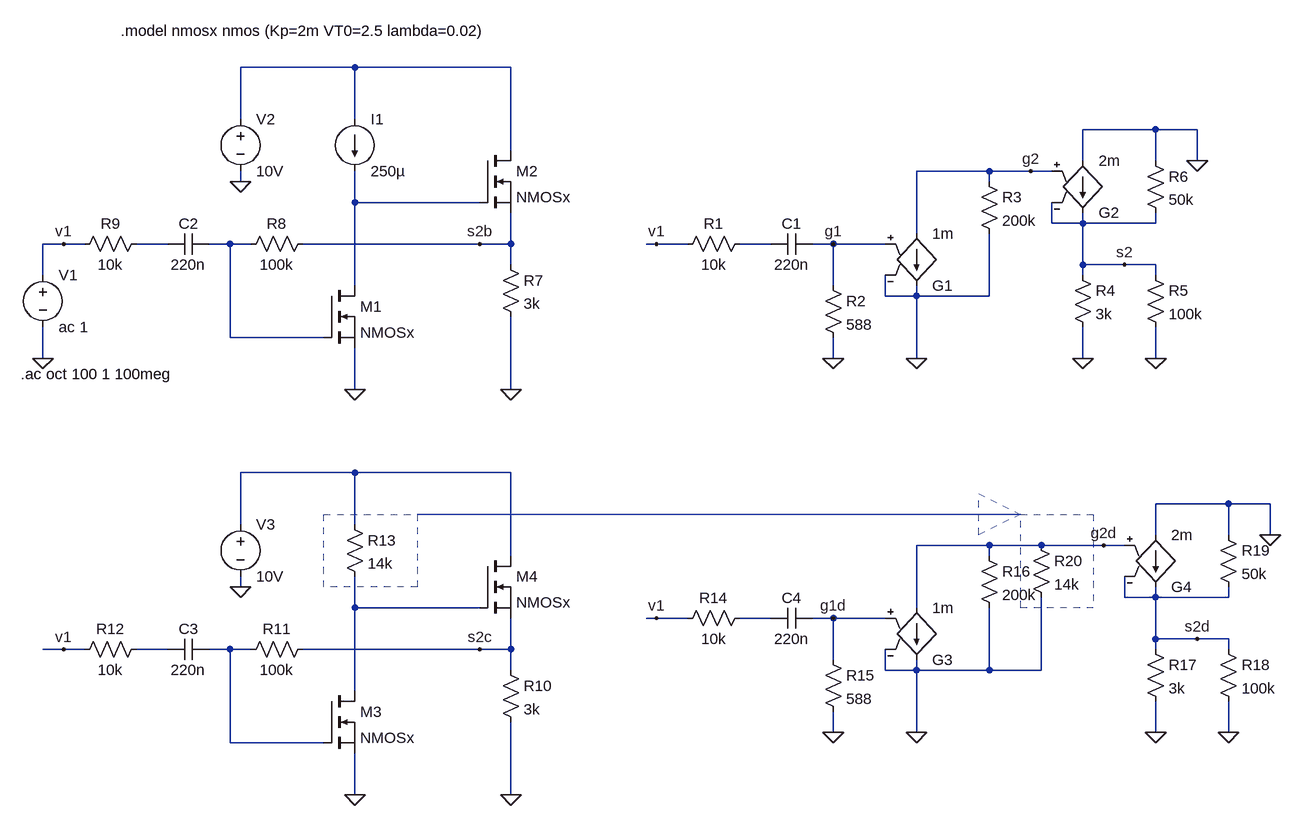
[diagram p0: schematic ss2011.asc]
ss2011.asc, the LTspice schematic file:
Version 4
SHEET 1 1156 1556
WIRE -448 -160 -624 -160
WIRE -208 -160 -448 -160
WIRE -624 -80 -624 -160
WIRE -448 -80 -448 -160
WIRE 784 -64 672 -64
WIRE 848 -64 784 -64
WIRE -208 -32 -208 -160
WIRE 672 -16 672 -64
WIRE 784 -16 784 -64
WIRE 848 -16 848 -64
WIRE 528 0 416 0
WIRE 592 0 528 0
WIRE 624 0 592 0
WIRE -624 16 -624 0
WIRE 528 16 528 0
WIRE -448 48 -448 0
WIRE -256 48 -448 48
WIRE 624 80 624 48
WIRE 672 80 672 64
WIRE 672 80 624 80
WIRE 784 80 784 64
WIRE 784 80 672 80
WIRE 416 96 416 0
WIRE -896 112 -928 112
WIRE -864 112 -896 112
WIRE -736 112 -784 112
WIRE -640 112 -672 112
WIRE -608 112 -640 112
WIRE -256 112 -528 112
WIRE -208 112 -208 64
WIRE -208 112 -256 112
WIRE 16 112 0 112
WIRE 64 112 16 112
WIRE 192 112 144 112
WIRE 288 112 256 112
WIRE 368 112 288 112
WIRE -208 144 -208 112
WIRE 672 144 672 80
WIRE 736 144 672 144
WIRE 784 144 736 144
WIRE -928 160 -928 112
WIRE 672 160 672 144
WIRE 784 160 784 144
WIRE -448 176 -448 48
WIRE 288 176 288 112
WIRE 368 192 368 160
WIRE 416 192 416 176
WIRE 416 192 368 192
WIRE 528 192 528 96
WIRE 528 192 416 192
WIRE -640 256 -640 112
WIRE -496 256 -640 256
WIRE -928 288 -928 240
WIRE 288 288 288 256
WIRE 416 288 416 192
WIRE 672 288 672 240
WIRE 784 288 784 240
WIRE -448 336 -448 272
WIRE -208 336 -208 224
WIRE -448 464 -624 464
WIRE -208 464 -448 464
WIRE 896 512 784 512
WIRE 960 512 896 512
WIRE -624 544 -624 464
WIRE -448 544 -448 464
WIRE 784 560 784 512
WIRE 896 560 896 512
WIRE 960 560 960 512
WIRE 528 576 416 576
WIRE 608 576 528 576
WIRE 704 576 608 576
WIRE 736 576 704 576
WIRE -208 592 -208 464
WIRE 528 592 528 576
WIRE -624 640 -624 624
WIRE 736 656 736 624
WIRE 784 656 784 640
WIRE 784 656 736 656
WIRE 896 656 896 640
WIRE 896 656 784 656
WIRE -448 672 -448 624
WIRE -256 672 -448 672
WIRE 416 672 416 576
WIRE 16 688 0 688
WIRE 64 688 16 688
WIRE 192 688 144 688
WIRE 288 688 256 688
WIRE 368 688 288 688
WIRE 784 720 784 656
WIRE 848 720 784 720
WIRE 896 720 848 720
WIRE -896 736 -928 736
WIRE -864 736 -896 736
WIRE -736 736 -784 736
WIRE -640 736 -672 736
WIRE -608 736 -640 736
WIRE -256 736 -528 736
WIRE -208 736 -208 688
WIRE -208 736 -256 736
WIRE 784 736 784 720
WIRE 896 736 896 720
WIRE 288 752 288 688
WIRE -208 768 -208 736
WIRE 368 768 368 736
WIRE 416 768 416 752
WIRE 416 768 368 768
WIRE 528 768 528 672
WIRE 528 768 416 768
WIRE 608 768 608 656
WIRE 608 768 528 768
WIRE -448 800 -448 672
WIRE 288 864 288 832
WIRE 416 864 416 768
WIRE 784 864 784 816
WIRE 896 864 896 816
WIRE -640 880 -640 736
WIRE -496 880 -640 880
WIRE -448 960 -448 896
WIRE -208 960 -208 848
FLAG 848 -16 0
FLAG 784 288 0
FLAG 672 288 0
FLAG 416 288 0
FLAG 288 288 0
FLAG -928 288 0
FLAG 736 144 s2
FLAG 592 0 g2
FLAG 288 112 g1
FLAG -208 336 0
FLAG -624 16 0
FLAG 16 112 v1
FLAG -448 336 0
FLAG -896 112 v1
FLAG -256 112 s2b
FLAG -208 960 0
FLAG -624 640 0
FLAG -448 960 0
FLAG -896 736 v1
FLAG -256 736 s2c
FLAG 960 560 0
FLAG 896 864 0
FLAG 784 864 0
FLAG 416 864 0
FLAG 288 864 0
FLAG 848 720 s2d
FLAG 704 576 g2d
FLAG 288 688 g1d
FLAG 16 688 v1
SYMBOL voltage -928 144 R0
SYMATTR InstName V1
SYMATTR Value ac 1
SYMBOL res 160 96 R90
WINDOW 0 0 56 VBottom 2
WINDOW 3 32 56 VTop 2
SYMATTR InstName R1
SYMATTR Value 10k
SYMBOL cap 256 96 R90
WINDOW 0 0 32 VBottom 2
WINDOW 3 32 32 VTop 2
SYMATTR InstName C1
SYMATTR Value 220n
SYMBOL res 272 160 R0
SYMATTR InstName R2
SYMATTR Value 588
SYMBOL res 512 0 R0
SYMATTR InstName R3
SYMATTR Value 200k
SYMBOL res 656 144 R0
SYMATTR InstName R4
SYMATTR Value 3k
SYMBOL res 768 144 R0
SYMATTR InstName R5
SYMATTR Value 100k
SYMBOL res 768 -32 R0
SYMATTR InstName R6
SYMATTR Value 50k
SYMBOL g2 416 192 M180
SYMATTR InstName G1
SYMATTR Value 1m
SYMBOL g2 672 80 M180
SYMATTR InstName G2
SYMATTR Value 2m
SYMBOL nmos -496 176 R0
SYMATTR InstName M1
SYMATTR Value NMOSx
SYMBOL nmos -256 -32 R0
SYMATTR InstName M2
SYMATTR Value NMOSx
SYMBOL current -448 -80 R0
WINDOW 123 0 0 Left 2
WINDOW 39 0 0 Left 2
SYMATTR InstName I1
SYMATTR Value 250µ
SYMBOL voltage -624 -96 R0
SYMATTR InstName V2
SYMATTR Value 10V
SYMBOL res -224 128 R0
SYMATTR InstName R7
SYMATTR Value 3k
SYMBOL res -512 96 R90
WINDOW 0 0 56 VBottom 2
WINDOW 3 32 56 VTop 2
SYMATTR InstName R8
SYMATTR Value 100k
SYMBOL res -768 96 R90
WINDOW 0 0 56 VBottom 2
WINDOW 3 32 56 VTop 2
SYMATTR InstName R9
SYMATTR Value 10k
SYMBOL cap -672 96 R90
WINDOW 0 0 32 VBottom 2
WINDOW 3 32 32 VTop 2
SYMATTR InstName C2
SYMATTR Value 220n
SYMBOL nmos -496 800 R0
SYMATTR InstName M3
SYMATTR Value NMOSx
SYMBOL nmos -256 592 R0
SYMATTR InstName M4
SYMATTR Value NMOSx
SYMBOL voltage -624 528 R0
SYMATTR InstName V3
SYMATTR Value 10V
SYMBOL res -224 752 R0
SYMATTR InstName R10
SYMATTR Value 3k
SYMBOL res -512 720 R90
WINDOW 0 0 56 VBottom 2
WINDOW 3 32 56 VTop 2
SYMATTR InstName R11
SYMATTR Value 100k
SYMBOL res -768 720 R90
WINDOW 0 0 56 VBottom 2
WINDOW 3 32 56 VTop 2
SYMATTR InstName R12
SYMATTR Value 10k
SYMBOL cap -672 720 R90
WINDOW 0 0 32 VBottom 2
WINDOW 3 32 32 VTop 2
SYMATTR InstName C3
SYMATTR Value 220n
SYMBOL res -464 528 R0
SYMATTR InstName R13
SYMATTR Value 14k
SYMBOL res 160 672 R90
WINDOW 0 0 56 VBottom 2
WINDOW 3 32 56 VTop 2
SYMATTR InstName R14
SYMATTR Value 10k
SYMBOL cap 256 672 R90
WINDOW 0 0 32 VBottom 2
WINDOW 3 32 32 VTop 2
SYMATTR InstName C4
SYMATTR Value 220n
SYMBOL res 272 736 R0
SYMATTR InstName R15
SYMATTR Value 588
SYMBOL res 512 576 R0
SYMATTR InstName R16
SYMATTR Value 200k
SYMBOL res 768 720 R0
SYMATTR InstName R17
SYMATTR Value 3k
SYMBOL res 880 720 R0
SYMATTR InstName R18
SYMATTR Value 100k
SYMBOL res 880 544 R0
SYMATTR InstName R19
SYMATTR Value 50k
SYMBOL g2 416 768 M180
SYMATTR InstName G3
SYMATTR Value 1m
SYMBOL g2 784 656 M180
SYMATTR InstName G4
SYMATTR Value 2m
SYMBOL res 592 560 R0
SYMATTR InstName R20
SYMATTR Value 14k
TEXT -962 312 Left 2 !.ac oct 100 1 100meg
TEXT -808 -216 Left 2 !.model nmosx nmos (Kp=2m VT0=2.5 lambda=0.02)
LINE Normal 576 528 -352 528
LINE Normal 512 496 576 528 2
LINE Normal 512 560 512 496 2
LINE Normal 576 528 512 560 2
RECTANGLE Normal -352 640 -496 528 2
RECTANGLE Normal 688 672 576 528 2

The netlist it stands for:
* ss2011.asc
V1 v1 0 ac 1
R1 N005 v1 10k
C1 g1 N005 220n
R2 g1 0 588
R3 g2 0 200k
R4 s2 0 3k
R5 s2 0 100k
R6 0 s2 50k
G1 g2 0 g1 0 1m
G2 0 s2 g2 s2 2m
M1 N002 N004 0 0 NMOSx
M2 N001 N002 s2b s2b NMOSx
I1 N001 N002 250µ
V2 N001 0 10V
R7 s2b 0 3k
R8 s2b N004 100k
R9 N003 v1 10k
C2 N004 N003 220n
M3 N007 N010 0 0 NMOSx
M4 N006 N007 s2c s2c NMOSx
V3 N006 0 10V
R10 s2c 0 3k
R11 s2c N010 100k
R12 N009 v1 10k
C3 N010 N009 220n
R13 N006 N007 14k
R14 N008 v1 10k
C4 g1d N008 220n
R15 g1d 0 588
R16 g2d 0 200k
R17 s2d 0 3k
R18 s2d 0 100k
R19 0 s2d 50k
G3 g2d 0 g1d 0 1m
G4 0 s2d g2d s2d 2m
R20 g2d 0 14k
.model NMOS NMOS
.model PMOS PMOS
.lib standard.mos
.ac oct 100 1 100meg
.model nmosx nmos (Kp=2m VT0=2.5 lambda=0.02)
.backanno
.end